# EAGLE schematic StepperDriver Rev1 (EAGLE 6.1)
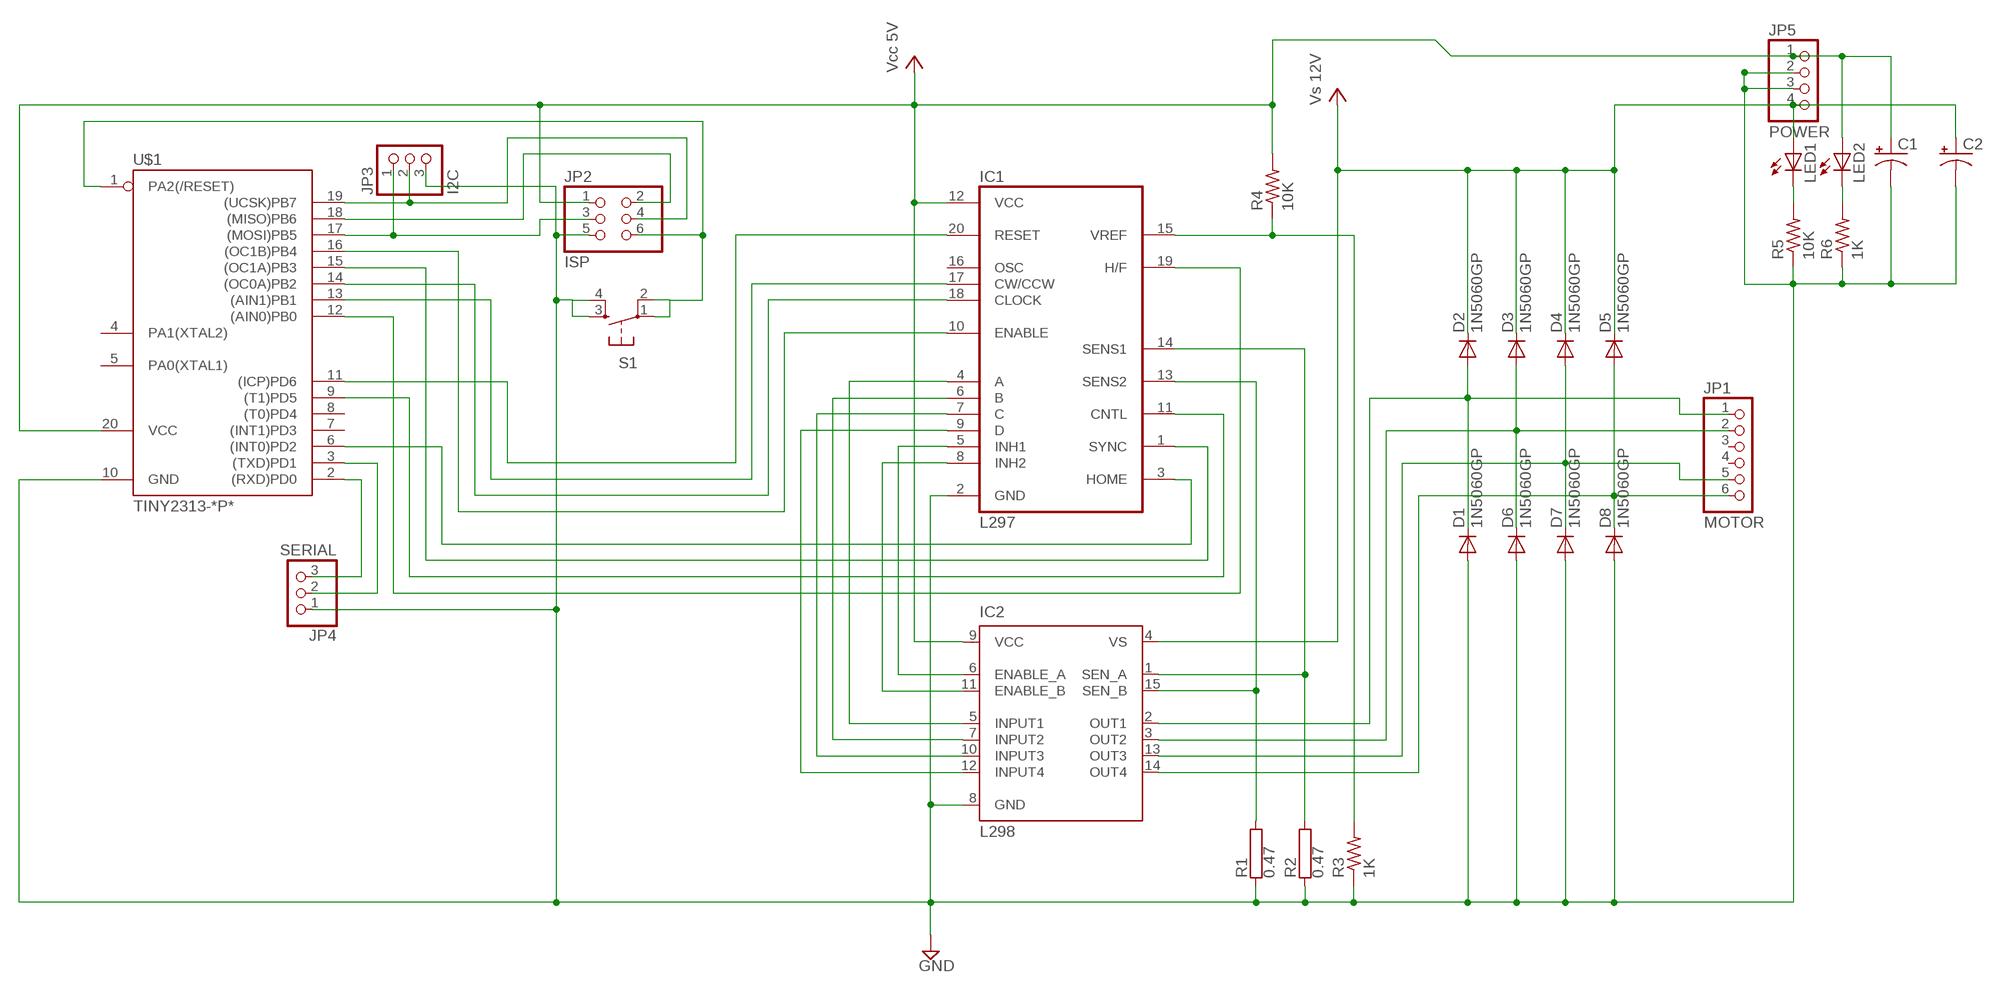
[diagram p0: schematic, sheet 1]

## Parts
C1  CPOL-USE2.5-6  [E2,5-6]
C2  CPOL-USE2.5-6  [E2,5-6]
D1  1N5060GP  [DO15-12]
D2  1N5060GP  [DO15-12]
D3  1N5060GP  [DO15-12]
D4  1N5060GP  [DO15-12]
D5  1N5060GP  [DO15-12]
D6  1N5060GP  [DO15-12]
D7  1N5060GP  [DO15-12]
D8  1N5060GP  [DO15-12]
IC1  L297  [DIL20]
IC2  L298  [MULTIWATT-15]
JP1  MOTOR  PINHD-1X6  [1X06]
JP2  ISP  PINHD-2X3  [2X03]
JP3  I2C  PINHD-1X3  [1X03]
JP4  SERIAL  PINHD-1X3  [1X03]
JP5  POWER  PINHD-1X4  [1X04]
LED1  LED5MM  [LED5MM]
LED2  LED5MM  [LED5MM]
R1  0.47  RHPS932  [HPS932]
R2  0.47  RHPS932  [HPS932]
R3  1K  R-US_0204/7  [0204/7]
R4  10K  R-US_0204/7  [0204/7]
R5  10K  R-US_0207/7  [0207/7]
R6  1K  R-US_0207/7  [0207/7]
S1  TAC_SWITCHPTH  [TACTILE-PTH]
U$1  TINY2313-*P*  [DIL20]

## Nets
GND: C1.- C2.- D1.A D6.A D7.A D8.A IC1.2(GND) IC2.8(GND) JP2.5 JP3.3 JP4.1 JP5.2 JP5.3 R1.1 R2.1 R3.1 R5.1 R6.1 S1.3 S1.4 U$1.10(GND)
N$2: IC1.13(SENS2) IC2.15(SEN_B) R1.2
N$4: IC1.14(SENS1) IC2.1(SEN_A) R2.2
N$5: C2.+ D2.C D3.C D4.C D5.C IC2.4(VS) JP5.4 LED1.A
N$6: IC1.10(ENABLE) U$1.16((OC1B)PB4)
N$9: IC1.18(CLOCK) U$1.14((OC0A)PB2)
N$10: IC1.17(CW/CCW) U$1.13((AIN1)PB1)
N$11: IC1.20(RESET) U$1.11((ICP)PD6)
N$12: LED1.K(C) R5.2
N$13: IC1.1(SYNC) U$1.15((OC1A)PB3)
N$14: LED2.K(C) R6.2
N$15: IC1.19(H/F) U$1.12((AIN0)PB0)
N$18: C1.+ IC1.12(VCC) IC2.9(VCC) JP2.1 JP5.1 LED2.A R4.2 U$1.20(VCC) ; supply symbol labelled Vcc 5V
N$19: D4.A D7.C IC2.13(OUT3) JP1.5
N$21: IC1.4(A) IC2.5(INPUT1)
N$22: JP4.2 U$1.3((TXD)PD1)
N$23: IC1.15(VREF) R3.2 R4.1
N$24: JP4.3 U$1.2((RXD)PD0)
N$25: JP2.3 JP3.1 U$1.17((MOSI)PB5)
N$26: JP2.2 U$1.18((MISO)PB6)
N$27: JP2.4 JP3.2 U$1.19((UCSK)PB7)
N$28: D1.C D2.A IC2.2(OUT1) JP1.1
N$29: IC1.5(INH1) IC2.6(ENABLE_A)
N$30: IC1.3(HOME) U$1.6((INT0)PD2)
N$32: JP2.6 S1.1 S1.2 U$1.1(PA2(/RESET))
N$33: IC1.6(B) IC2.7(INPUT2)
N$34: IC1.7(C) IC2.10(INPUT3)
N$35: D5.A D8.C IC2.14(OUT4) JP1.6
N$36: IC1.8(INH2) IC2.11(ENABLE_B)
N$37: IC1.9(D) IC2.12(INPUT4)
N$38: D3.A D6.C IC2.3(OUT2) JP1.2
N$39: IC1.11(CNTL) U$1.9((T1)PD5)
Unconnected: IC1.16(OSC) JP1.3 JP1.4 U$1.4(PA1(XTAL2)) U$1.5(PA0(XTAL1)) U$1.7((INT1)PD3) U$1.8((T0)PD4)

## Library data of the parts
C1 C2 = resistor:CPOL-US: POLARIZED CAPACITOR, American symbol
D1-D8 = diode:1N5060GP: DIODE controlled avalanche rectifier
IC1 = st-microelectronics:L297: STEPPER MOTOR CONTROLLER; MPN: L297/1; OC_FARNELL: 1094209; OC_NEWARK: 56P8258
IC2 = st-microelectronics:L298: DUAL FULL-BRIDGE DRIVER; MPN: L298N; OC_FARNELL: 1589425; OC_NEWARK: 32M1527
JP1 = pinhead:PINHD-1X6: PIN HEADER
JP2 = pinhead:PINHD-2X3: PIN HEADER
JP3 JP4 = pinhead:PINHD-1X3: PIN HEADER
JP5 = pinhead:PINHD-1X4: PIN HEADER
LED1 LED2 = led:LED: LED OSRAM: - CHIPLED LG R971, LG N971, LY N971, LG Q971, LY Q971, LO R971, LY R971 LH N974, LH R974 LS Q976, LO Q976, LY Q976 LO Q996 - Hyper CHIPLED LW Q18S LB Q993, LB Q99A, LB R99A - SideLED LS A670, LO A670, LY A670, LG A670, LP A670 LB A673, LV A673, LT A673, LW A673 LH A674 LY A675 LS A676, LA A676, LO A676, LY A676, LW A676 LS A679, LY A679, LG A679 - Hyper Micro SIDELED® LS Y876, LA Y876, LO Y876, LY Y876 LT Y87S - SmartLED LW L88C, LW L88S LB L89C, LB L89S, LG L890 LS L89K, LO L89K, LY L89K LS L896, LA L896, LO L896, LY L896 - TOPLED LS T670, LO T670, LY T670, LG T670, LP T670 LSG T670, LSP T670, LSY T670, LOP T670, LYG T670 LG T671, LOG T671, LSG T671 LB T673, LV T673, LT T673, LW T673 LH T674 LS T676, LA T676, LO T676, LY T676, LB T676, LH T676, LSB T676, LW T676 LB T67C, LV T67C, LT T67C, LS T67K, LO T67K, LY T67K, LW E67C LS E67B, LA E67B, LO E67B, LY E67B, LB E67C, LV E67C, LT E67C LW T67C LS T679, LY T679, LG T679 LS T770, LO T770, LY T770, LG T770, LP T770 LB T773, LV T773, LT T773, LW T773 LH T774 LS E675, LA E675, LY E675, LS T675 LS T776, LA T776, LO T776, LY T776, LB T776 LHGB T686 LT T68C, LB T68C - Hyper Mini TOPLED® LB M676 - Mini TOPLED Santana® LG M470 LS M47K, LO M47K, LY M47K Source: http://www.osram.convergy.de LUXEON: - LUMILED® LXK2-PW12-R00, LXK2-PW12-S00, LXK2-PW14-U00, LXK2-PW14-V00 LXK2-PM12-R00, LXK2-PM12-S00, LXK2-PM14-U00 LXK2-PE12-Q00, LXK2-PE12-R00, LXK2-PE12-S00, LXK2-PE14-T00, LXK2-PE14-U00 LXK2-PB12-K00, LXK2-PB12-L00, LXK2-PB12-M00, LXK2-PB14-N00, LXK2-PB14-P00, LXK2-PB14-Q00 LXK2-PR12-L00, LXK2-PR12-M00, LXK2-PR14-Q00, LXK2-PR14-R00 LXK2-PD12-Q00, LXK2-PD12-R00, LXK2-PD12-S00 LXK2-PH12-R00, LXK2-PH12-S00 LXK2-PL12-P00, LXK2-PL12-Q00, LXK2-PL12-R00 Source: www.luxeon.com KINGBRIGHT: KA-3528ASYC Source: www.kingbright.com
R1 R2 = resistor-power:R: Power Resitor; OC_FARNELL: unknown; OC_NEWARK: unknown
R3-R6 = resistor:R-US_: RESISTOR, American symbol
S1 = SparkFun-Electromechanical:TAC_SWITCH: Momentary Switch Button commonly used for reset or general input. Spark Fun Electronics SKU : COM-00097
U$1 = avr-7:TINY2313*: Atmel Tiny2313 2K Flash, 128 bytes EEPROM, 128 bytes RAM